# EAGLE schematic ECEN 4350 Lab 3 (EAGLE 9.6.2)

## Sheet 1 of 7
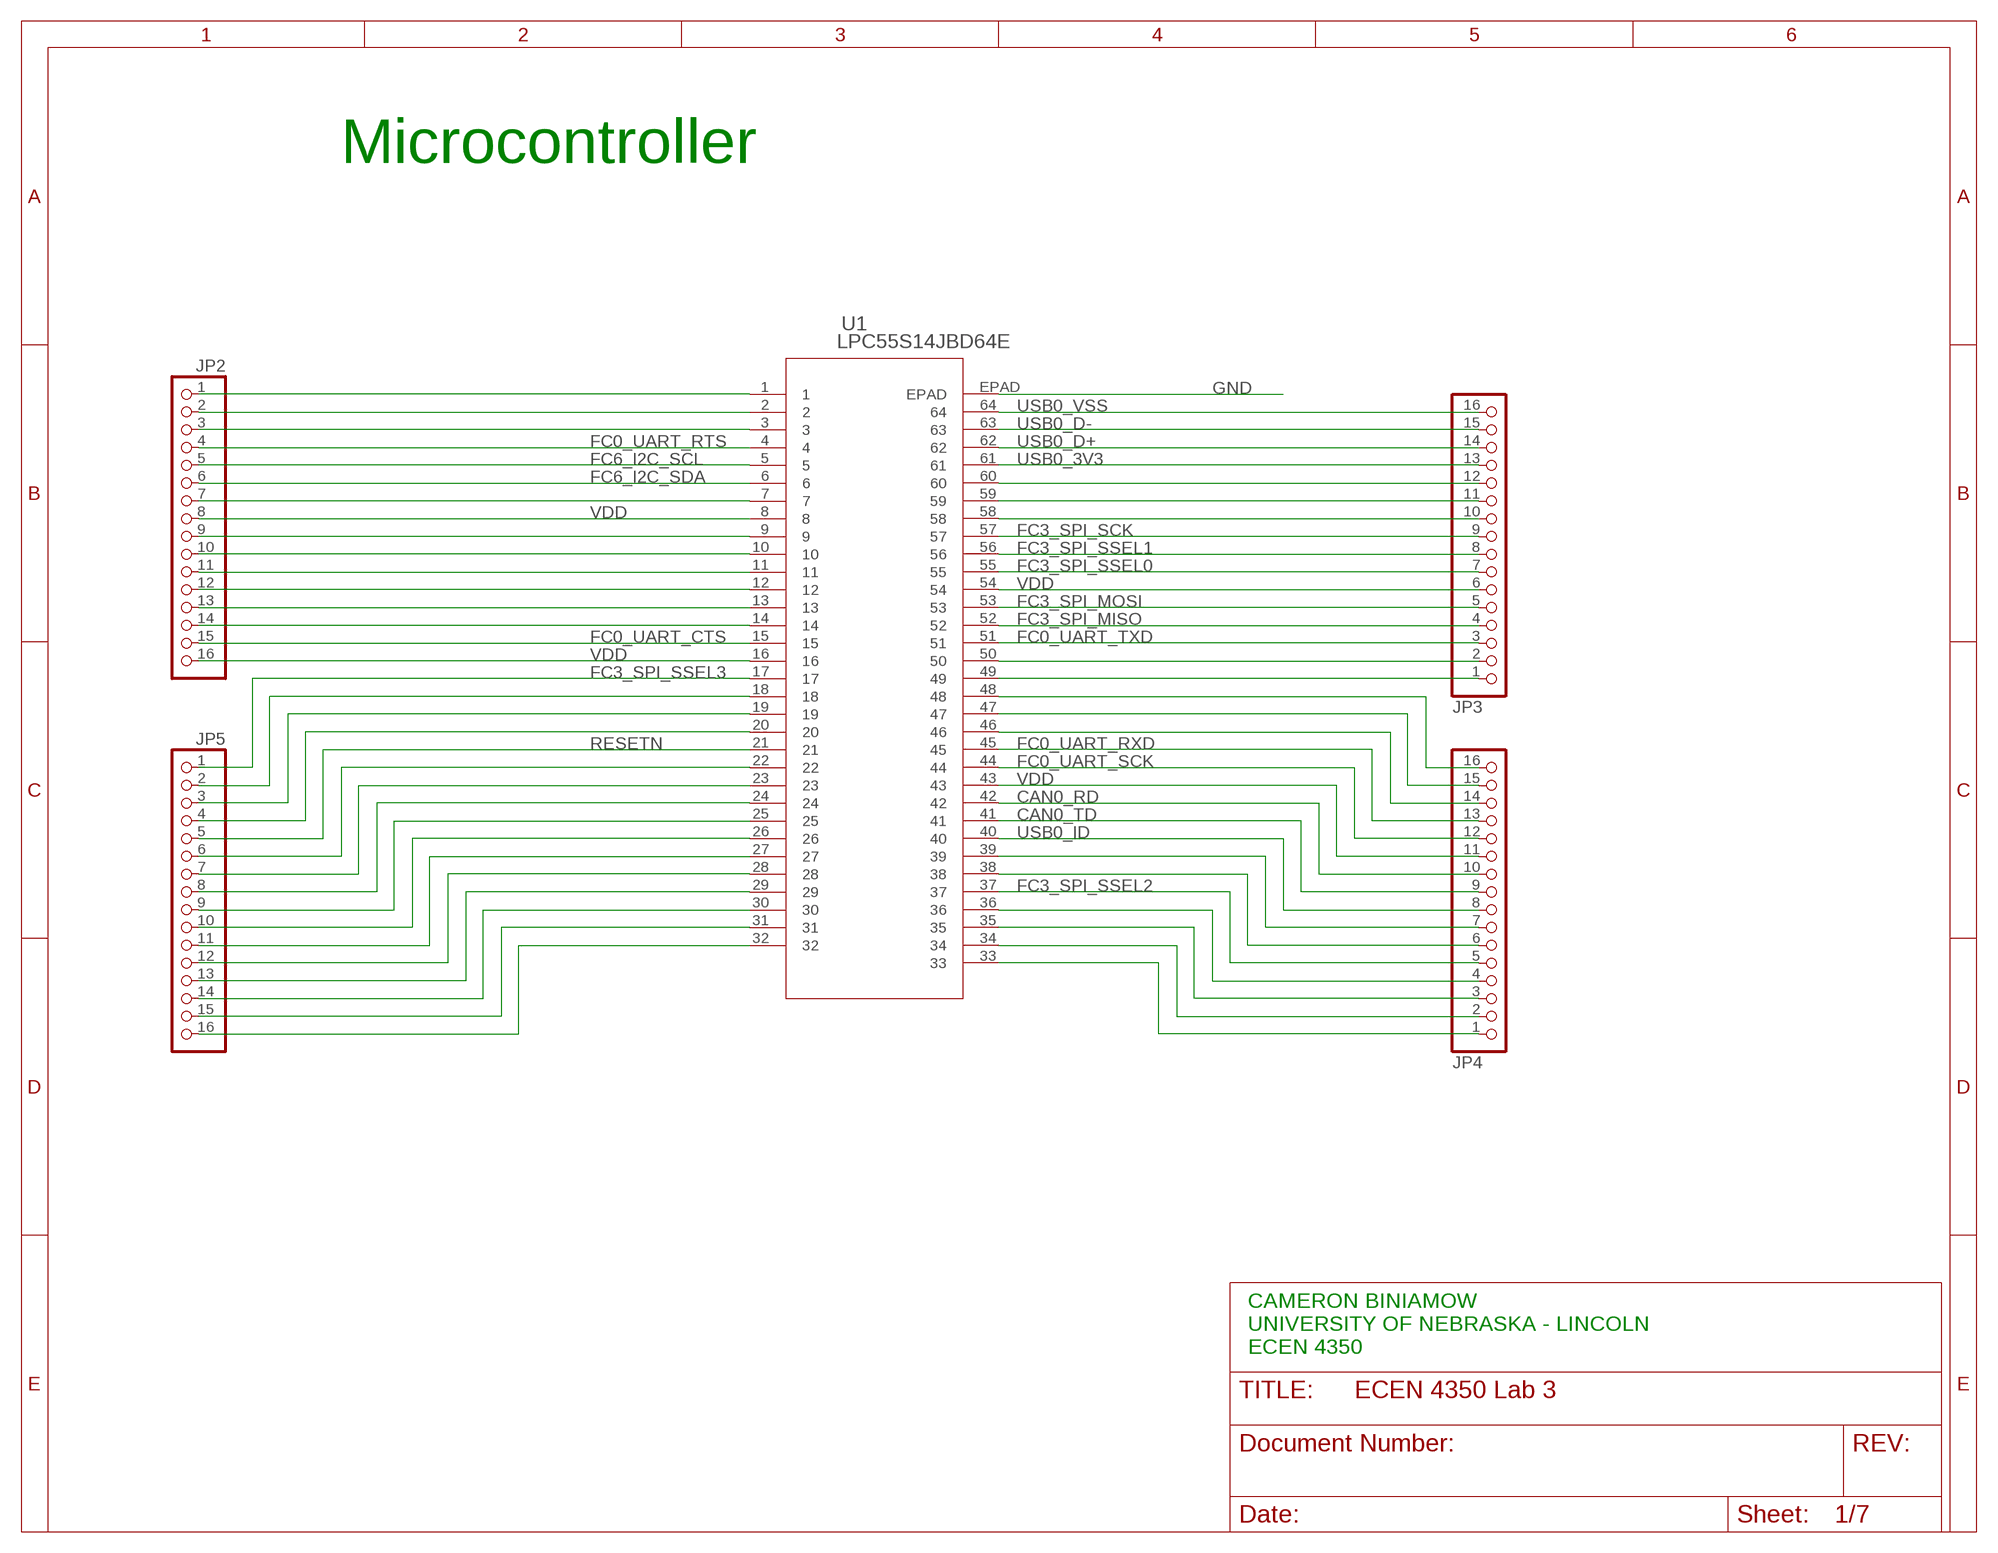
[diagram p0: schematic, sheet 1]

### Parts
JP2  PINHD-1X16  [1X16]
JP3  PINHD-1X16  [1X16]
JP4  PINHD-1X16  [1X16]
JP5  PINHD-1X16  [1X16]
U1  LPC55S14JBD64E  [HTQFP64_10X10_NXP]

### Nets
CAN0_RD: JP4.10 U1.42 ; also sheet 2
CAN0_TD: JP4.9 U1.41 ; also sheet 2
FC0_UART_CTS: JP2.15 U1.15
FC0_UART_RTS: JP2.4 U1.4
FC0_UART_RXD: JP4.13 U1.45 ; also sheet 4
FC0_UART_SCK: JP4.12 U1.44
FC0_UART_TXD: JP3.3 U1.51 ; also sheet 4
FC2_I2C_SCL: JP5.2 U1.18 ; also sheet 7
FC3_SPI_MISO: JP3.4 U1.52 ; also sheet 5,6
FC3_SPI_MOSI: JP3.5 U1.53 ; also sheet 5,6
FC3_SPI_SCK: JP3.9 JP4.4 U1.36 U1.57 ; also sheet 5,6
FC3_SPI_SSEL0: JP3.7 U1.55 ; also sheet 5
FC3_SPI_SSEL1: JP3.8 U1.56 ; also sheet 6
FC3_SPI_SSEL2: JP4.5 U1.37
FC3_SPI_SSEL3: JP5.1 U1.17
FC6_I2C_SCL: JP2.5 U1.5 ; also sheet 6,7
FC6_I2C_SDA: JP2.6 U1.6 ; also sheet 6,7
GND: U1.EPAD ; also sheet 4,6,7
N$1: JP2.1 U1.1
N$2: JP2.2 U1.2
N$3: JP2.3 U1.3
N$7: JP2.7 U1.7
N$9: JP2.9 U1.9
N$10: JP2.10 U1.10
N$11: JP2.11 U1.11
N$12: JP2.12 U1.12
N$13: JP2.13 U1.13
N$14: JP2.14 U1.14
N$19: JP5.3 U1.19
N$20: JP5.4 U1.20
N$22: JP5.6 U1.22
N$23: JP5.7 U1.23
N$24: JP5.8 U1.24
N$25: JP5.9 U1.25
N$26: JP5.10 U1.26
N$27: JP5.11 U1.27
N$28: JP5.12 U1.28
N$29: JP5.13 U1.29
N$30: JP5.14 U1.30
N$31: JP5.15 U1.31
N$32: JP5.16 U1.32
N$40: JP3.12 U1.60
N$41: JP3.11 U1.59
N$42: JP3.10 U1.58
N$50: JP3.2 U1.50
N$51: JP3.1 U1.49
N$52: JP4.16 U1.48
N$53: JP4.15 U1.47
N$54: JP4.14 U1.46
N$62: JP4.7 U1.39
N$63: JP4.6 U1.38
N$66: JP4.3 U1.35
N$67: JP4.2 U1.34
N$68: JP4.1 U1.33
RESETN: JP5.5 U1.21
USB0_3V3: JP3.13 U1.61
USB0_D+: JP3.14 U1.62 ; also sheet 3
USB0_D-: JP3.15 U1.63 ; also sheet 3
USB0_ID: JP4.8 U1.40 ; also sheet 3
USB0_VSS: JP3.16 U1.64
VDD: JP2.8 JP2.16 JP3.6 JP4.11 U1.8 U1.16 U1.43 U1.54

### Notes on the sheet
- Microcontroller
- CAMERON BINIAMOW
  UNIVERSITY OF NEBRASKA - LINCOLN
  ECEN 4350

## Sheet 2 of 7: Can Transceiver
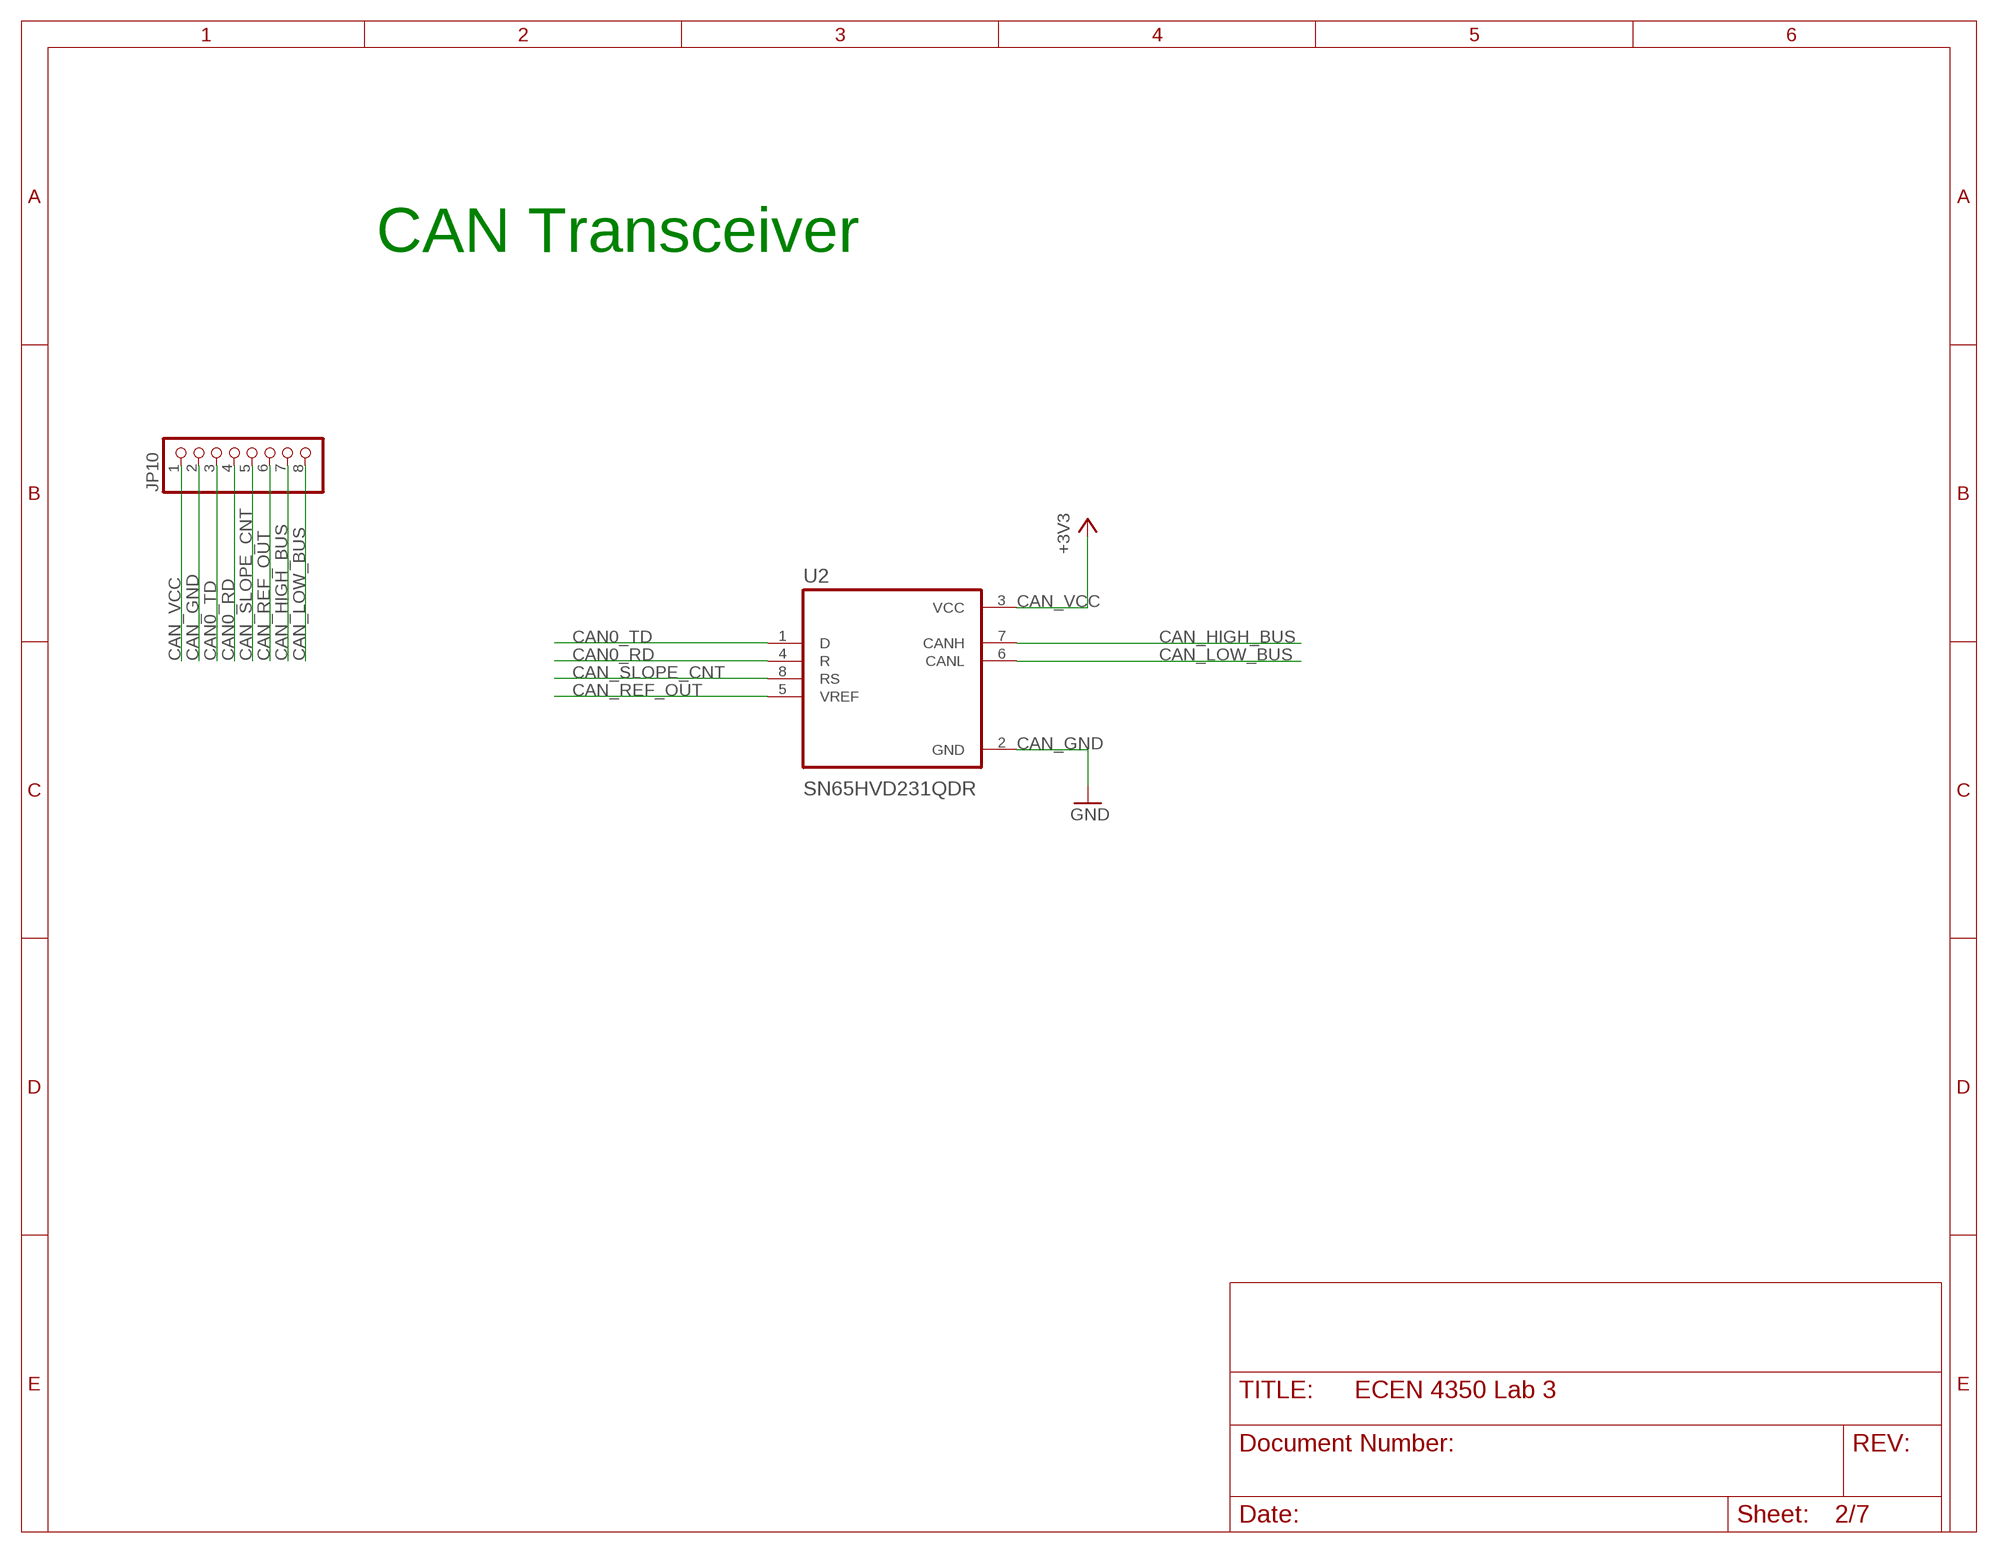
[diagram p1: schematic, sheet 2]

### Parts
JP10  PINHD-1X8  [1X08]
U2  SN65HVD231QDR  [SOIC127P599X175-8N]

### Nets
CAN0_RD: JP10.4 U2.4(R) ; also sheet 1
CAN0_TD: JP10.3 U2.1(D) ; also sheet 1
CAN_GND: JP10.2 U2.2(GND) ; supply symbol labelled GND
CAN_HIGH_BUS: JP10.7 U2.7(CANH)
CAN_LOW_BUS: JP10.8 U2.6(CANL)
CAN_REF_OUT: JP10.6 U2.5(VREF)
CAN_SLOPE_CNT: JP10.5 U2.8(RS)
CAN_VCC: JP10.1 U2.3(VCC) ; supply symbol labelled +3V3

### Notes on the sheet
- CAN Transceiver

## Sheet 3 of 7
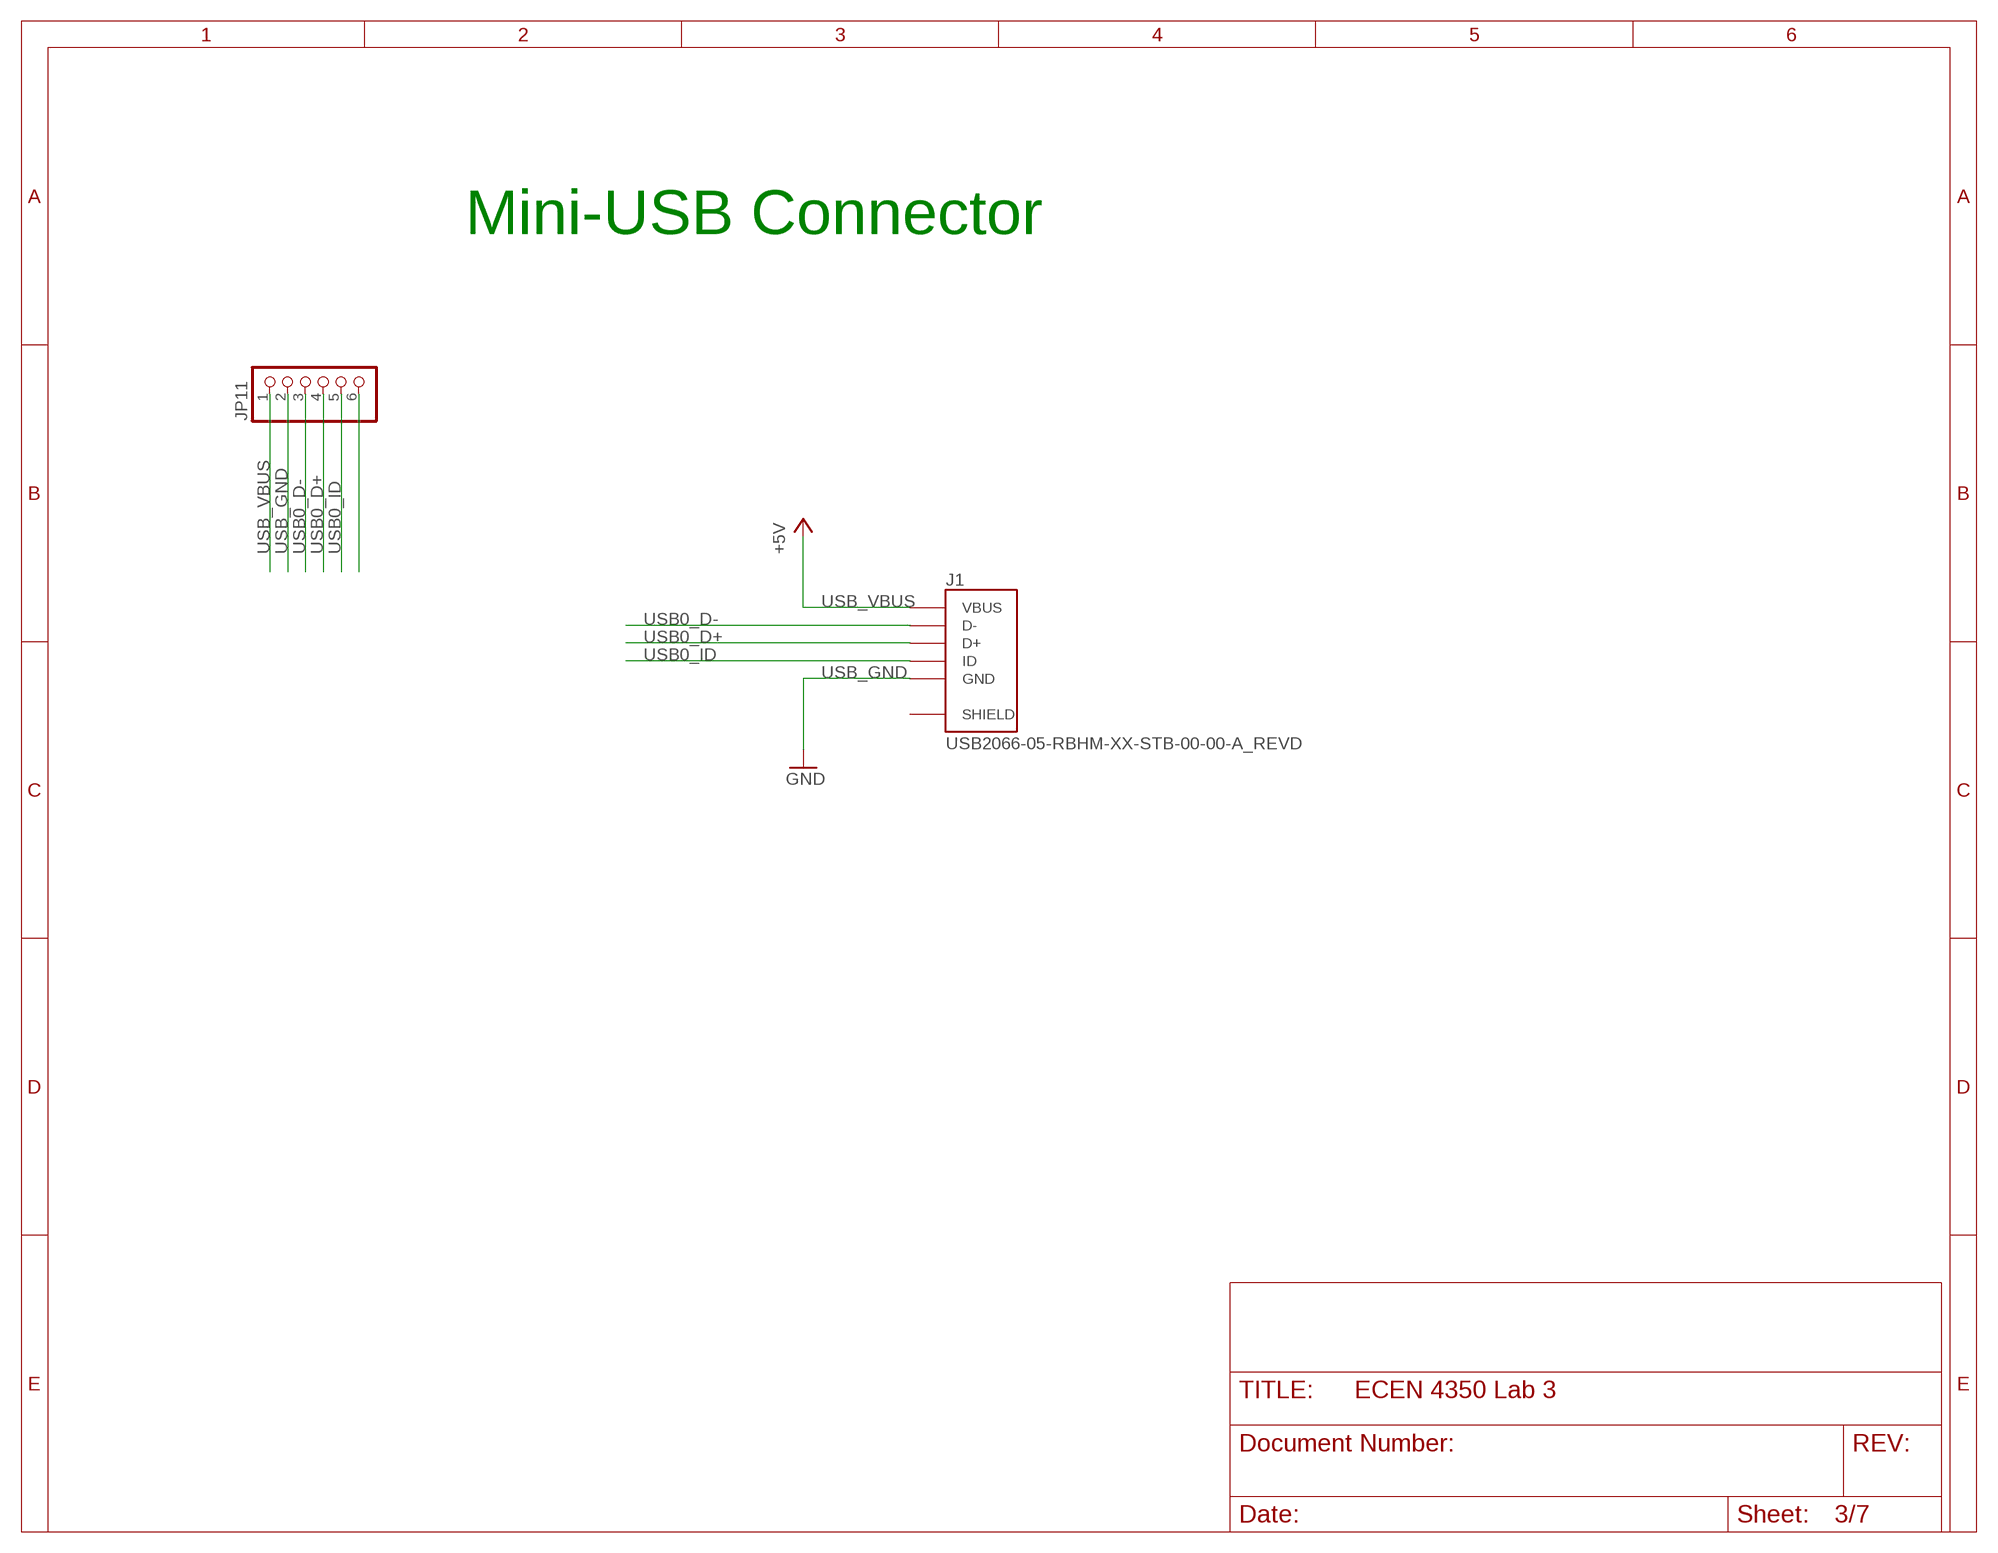
[diagram p2: schematic, sheet 3]

### Parts
J1  USB2066-05-RBHM-XX-STB-00-00-A_REVD  [GCT_USB2066-05-RBHM-XX-STB-00-00-A_REVD]
JP11  PINHD-1X6  [1X06]

### Nets
N$16: JP11.6
USB0_D+: J1.3(D+) JP11.4 ; also sheet 1
USB0_D-: J1.2(D-) JP11.3 ; also sheet 1
USB0_ID: J1.4(ID) JP11.5 ; also sheet 1
USB_GND: J1.5(GND) JP11.2 ; supply symbol labelled GND
USB_VBUS: J1.1(VBUS) JP11.1 ; supply symbol labelled +5V

### Notes on the sheet
- Mini-USB Connector

## Sheet 4 of 7
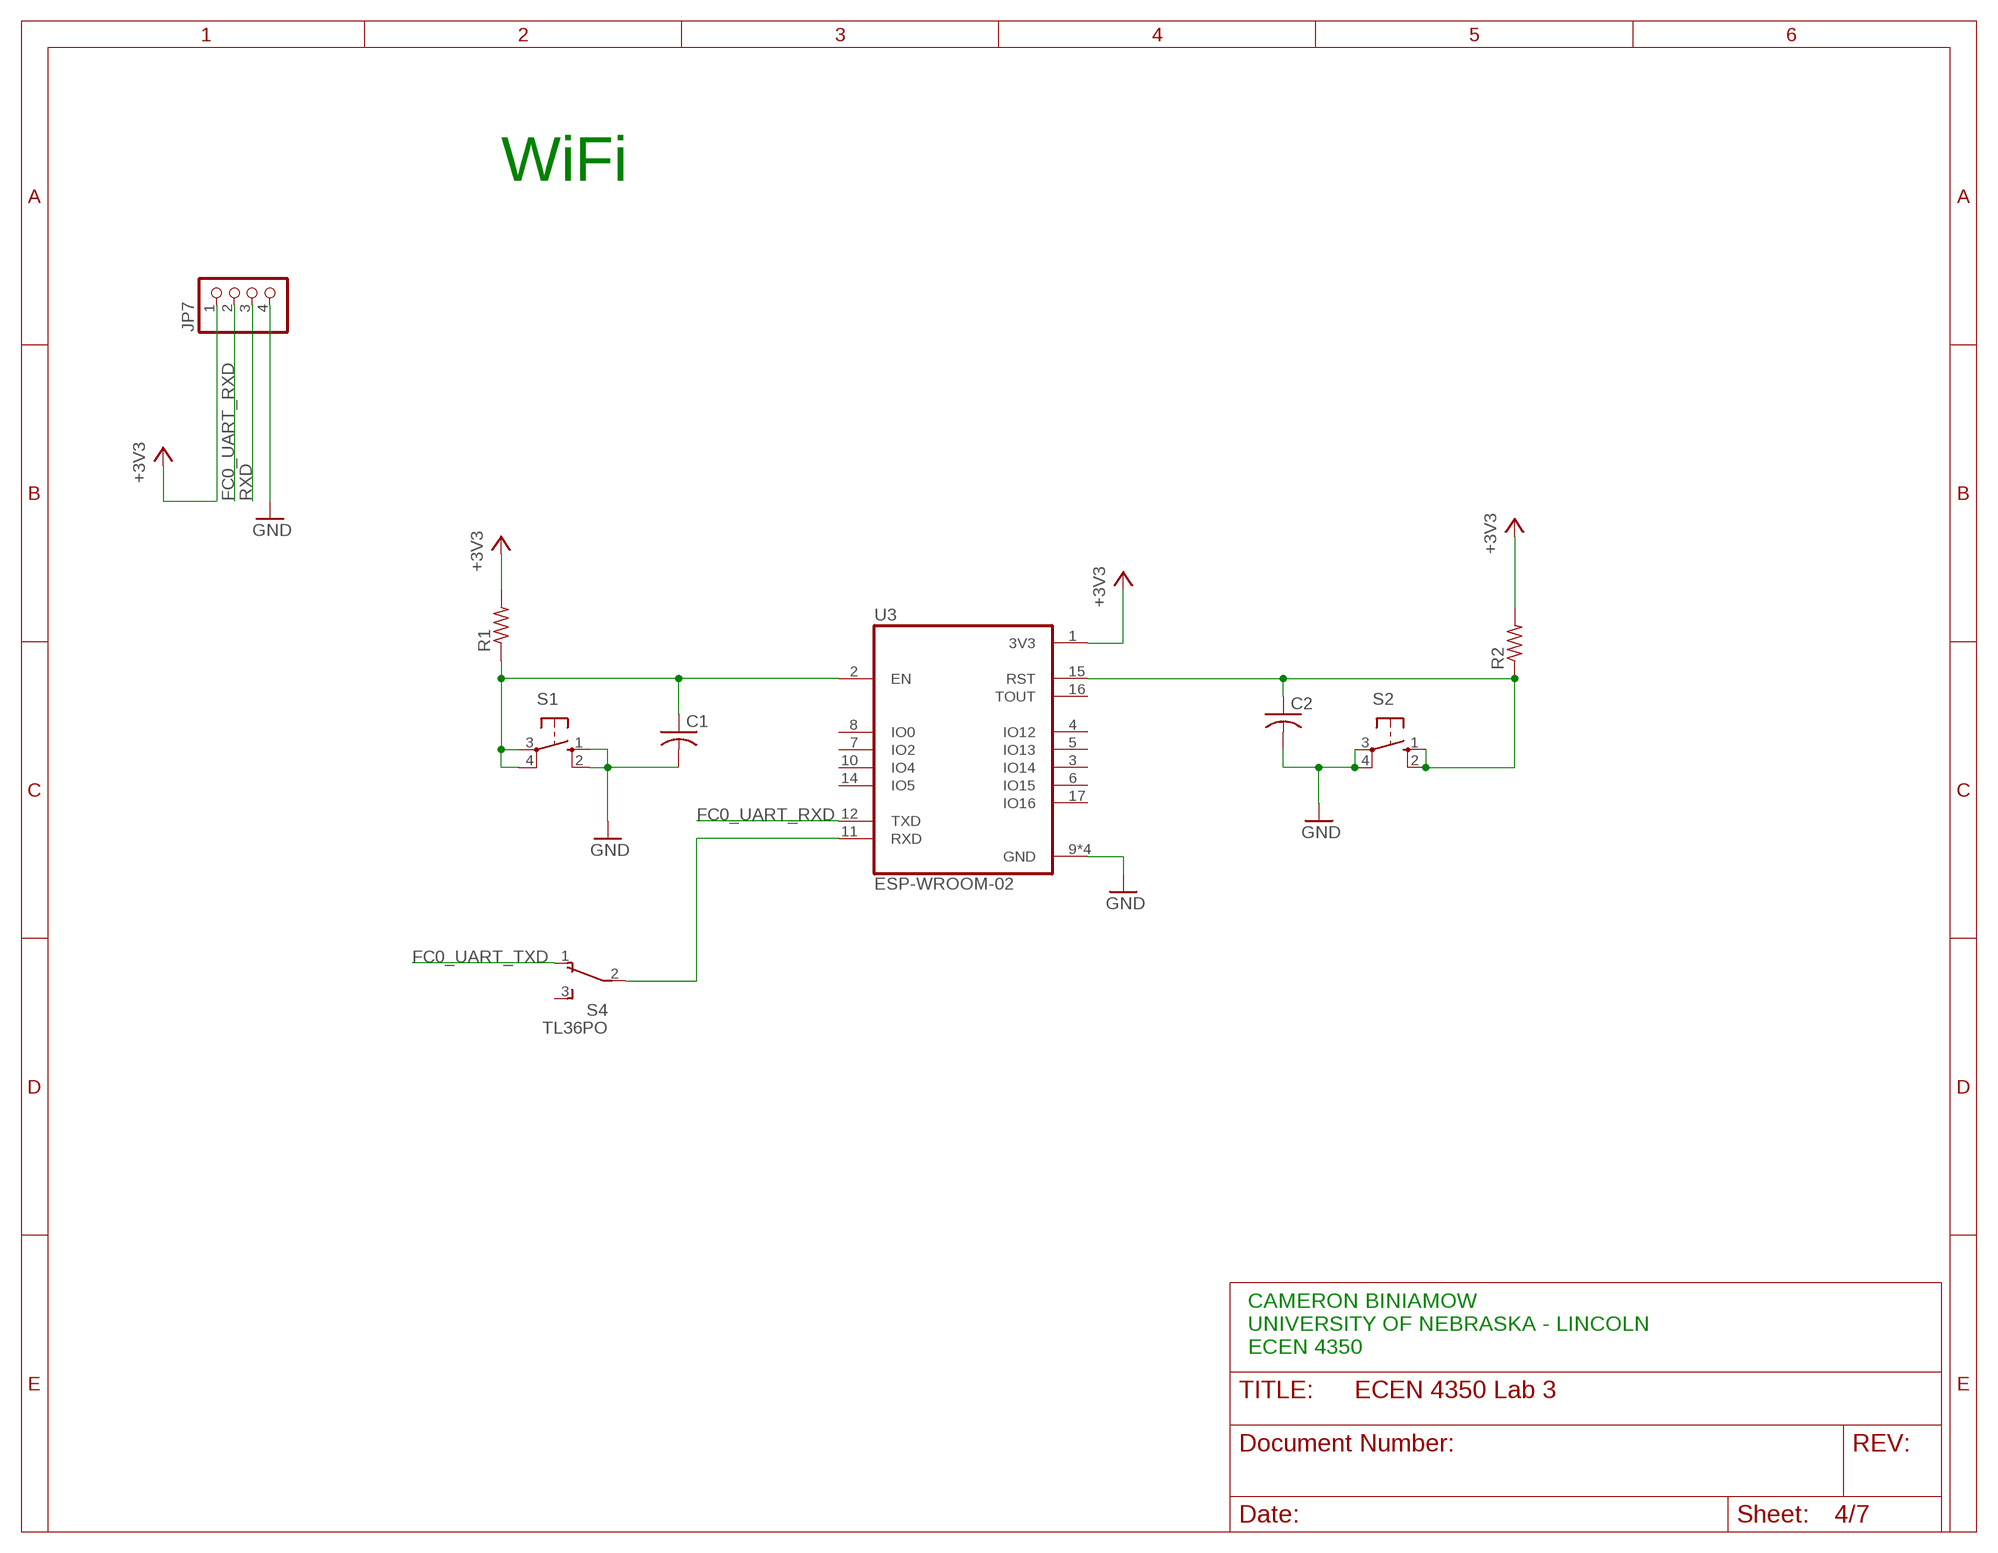
[diagram p3: schematic, sheet 4]

### Parts
C1  C-USC1206  [C1206]
C2  C-USC1206  [C1206]
JP7  PINHD-1X4  [1X04]
R1  R-US_R1206  [R1206]
R2  R-US_R1206  [R1206]
S1  10-XX  [B3F-10XX]
S2  10-XX  [B3F-10XX]
S4  TL36PO  [TL3XPO]
U3  ESP-WROOM-02  [MODULE_ESP-WROOM-02]

### Nets
+3V3: JP7.1 R1.2 R2.2 U3.1(3V3) ; also sheet 7
FC0_UART_RXD: JP7.2 U3.12(TXD) ; also sheet 1
FC0_UART_TXD: S4.1(O) ; also sheet 1
GND: C1.2 C2.2 JP7.4 S1.1(S) S1.2(S1) S2.3(P) S2.4(P1) U3.9(GND) U3.13(GND) U3.18(GND) U3.19(GND) ; also sheet 1,6,7
N$33: C1.1 R1.1 S1.3(P) S1.4(P1) U3.2(EN)
N$34: C2.1 R2.1 S2.1(S) S2.2(S1) U3.15(RST)
RXD: JP7.3 S4.2(P) U3.11(RXD)
Unconnected: S4.3(S) U3.3(IO14) U3.4(IO12) U3.5(IO13) U3.6(IO15) U3.7(IO2) U3.8(IO0) U3.10(IO4) U3.14(IO5) U3.16(TOUT) U3.17(IO16)

### Notes on the sheet
- WiFi
- CAMERON BINIAMOW
  UNIVERSITY OF NEBRASKA - LINCOLN
  ECEN 4350

## Sheet 5 of 7
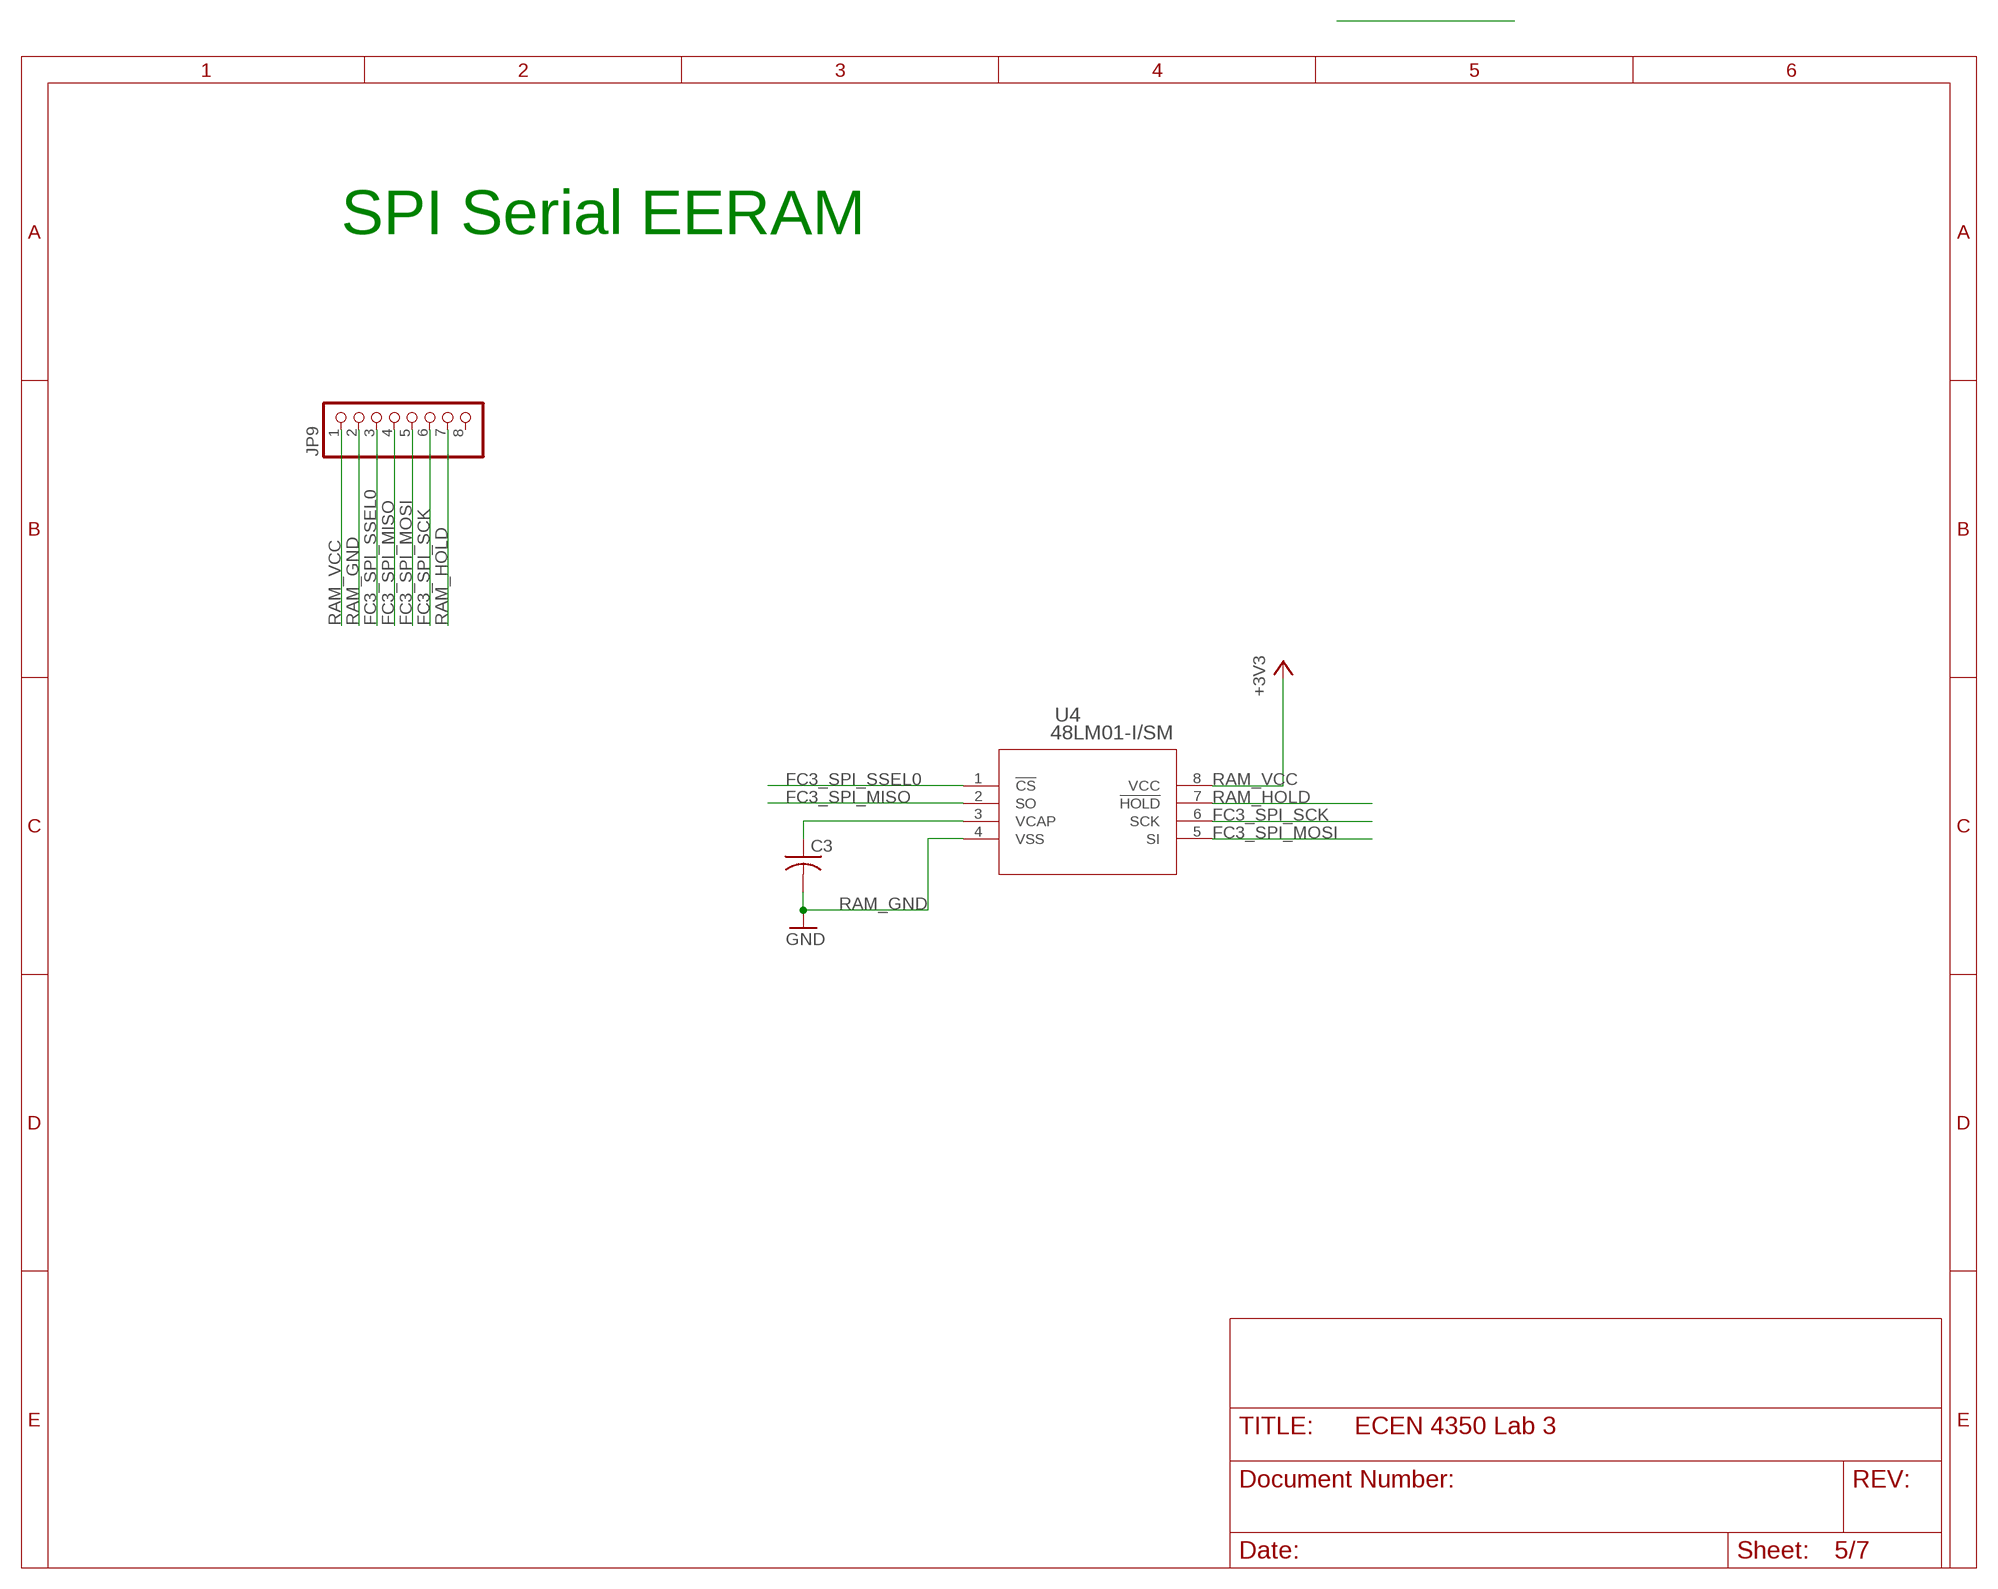
[diagram p4: schematic, sheet 5]

### Parts
C3  C-USC1206  [C1206]
JP9  PINHD-1X8  [1X08]
U4  48LM01-I/SM  [SOIJ8_SM_MCH]

### Nets
FC3_SPI_MISO: JP9.4 U4.2(SO) ; also sheet 1,6
FC3_SPI_MOSI: JP9.5 U4.5(SI) ; also sheet 1,6
FC3_SPI_SCK: JP9.6 U4.6(SCK) ; also sheet 1,6
FC3_SPI_SSEL0: JP9.3 U4.1(!CS) ; also sheet 1
N$35: C3.1 U4.3(VCAP)
N$74: U2.1(D)
RAM_GND: C3.2 JP9.2 U4.4(VSS) ; supply symbol labelled GND
RAM_HOLD: JP9.7 U4.7(!HOLD)
RAM_VCC: JP9.1 U4.8(VCC) ; supply symbol labelled +3V3
Unconnected: JP9.8

### Notes on the sheet
- SPI Serial EERAM

## Sheet 6 of 7
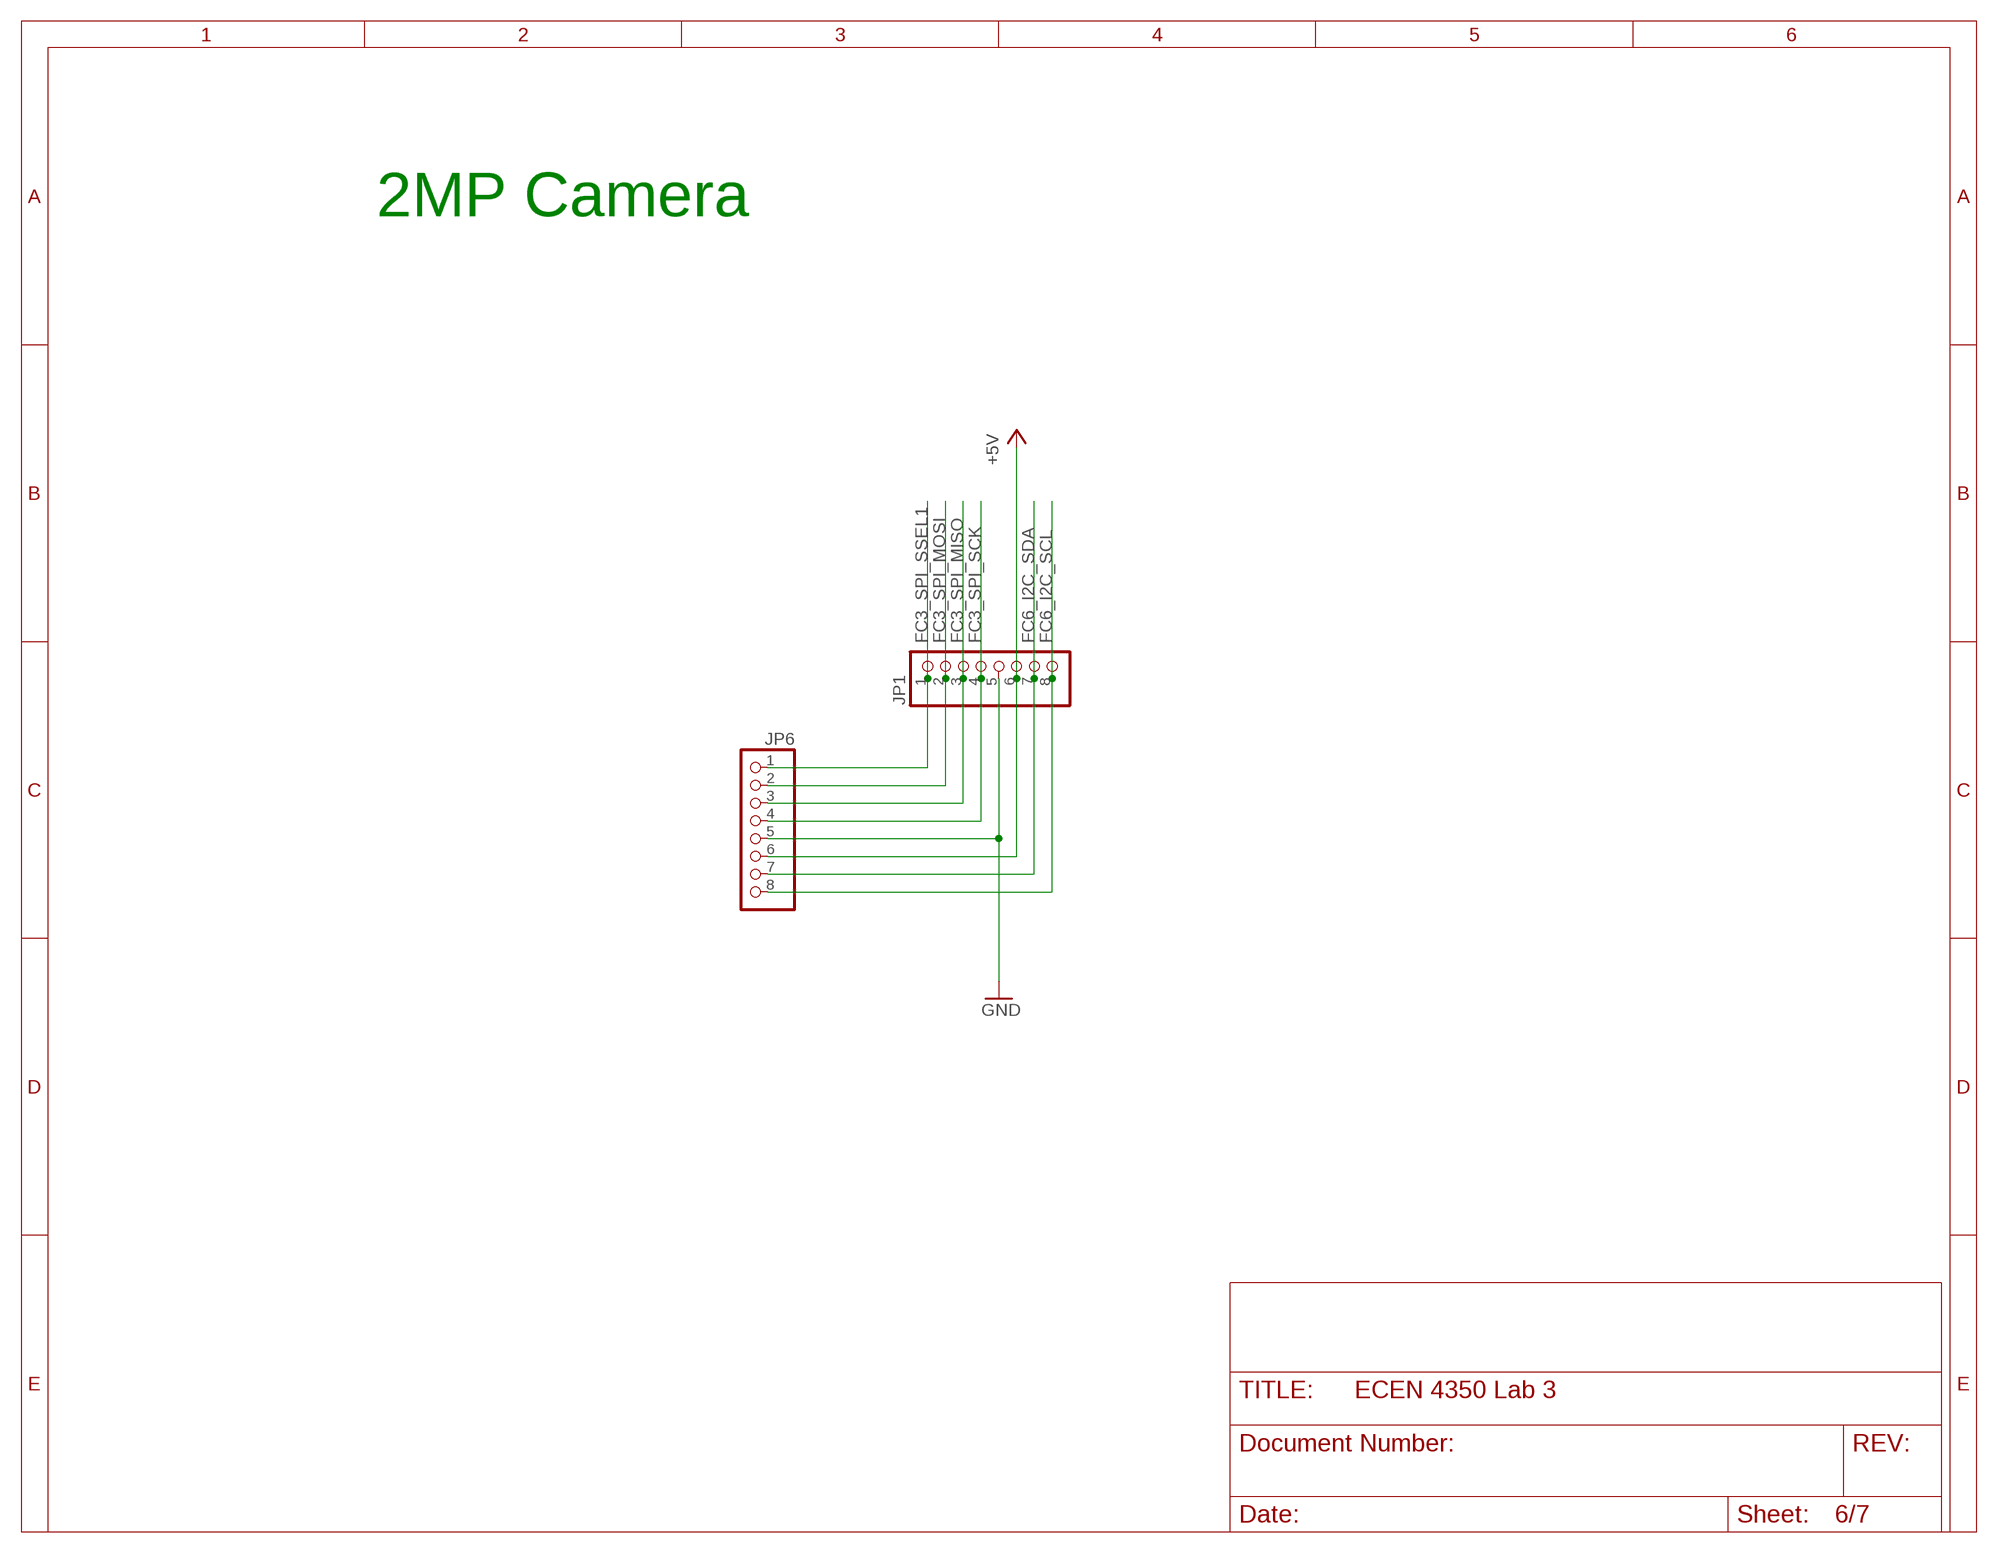
[diagram p5: schematic, sheet 6]

### Parts
JP1  PINHD-1X8  [1X08]
JP6  PINHD-1X8  [1X08]

### Nets
+5V: JP1.6 JP6.6
FC3_SPI_MISO: JP1.3 JP6.3 ; also sheet 1,5
FC3_SPI_MOSI: JP1.2 JP6.2 ; also sheet 1,5
FC3_SPI_SCK: JP1.4 JP6.4 ; also sheet 1,5
FC3_SPI_SSEL1: JP1.1 JP6.1 ; also sheet 1
FC6_I2C_SCL: JP1.8 JP6.8 ; also sheet 1,7
FC6_I2C_SDA: JP1.7 JP6.7 ; also sheet 1,7
GND: JP1.5 JP6.5 ; also sheet 1,4,7

### Notes on the sheet
- 2MP Camera

## Sheet 7 of 7
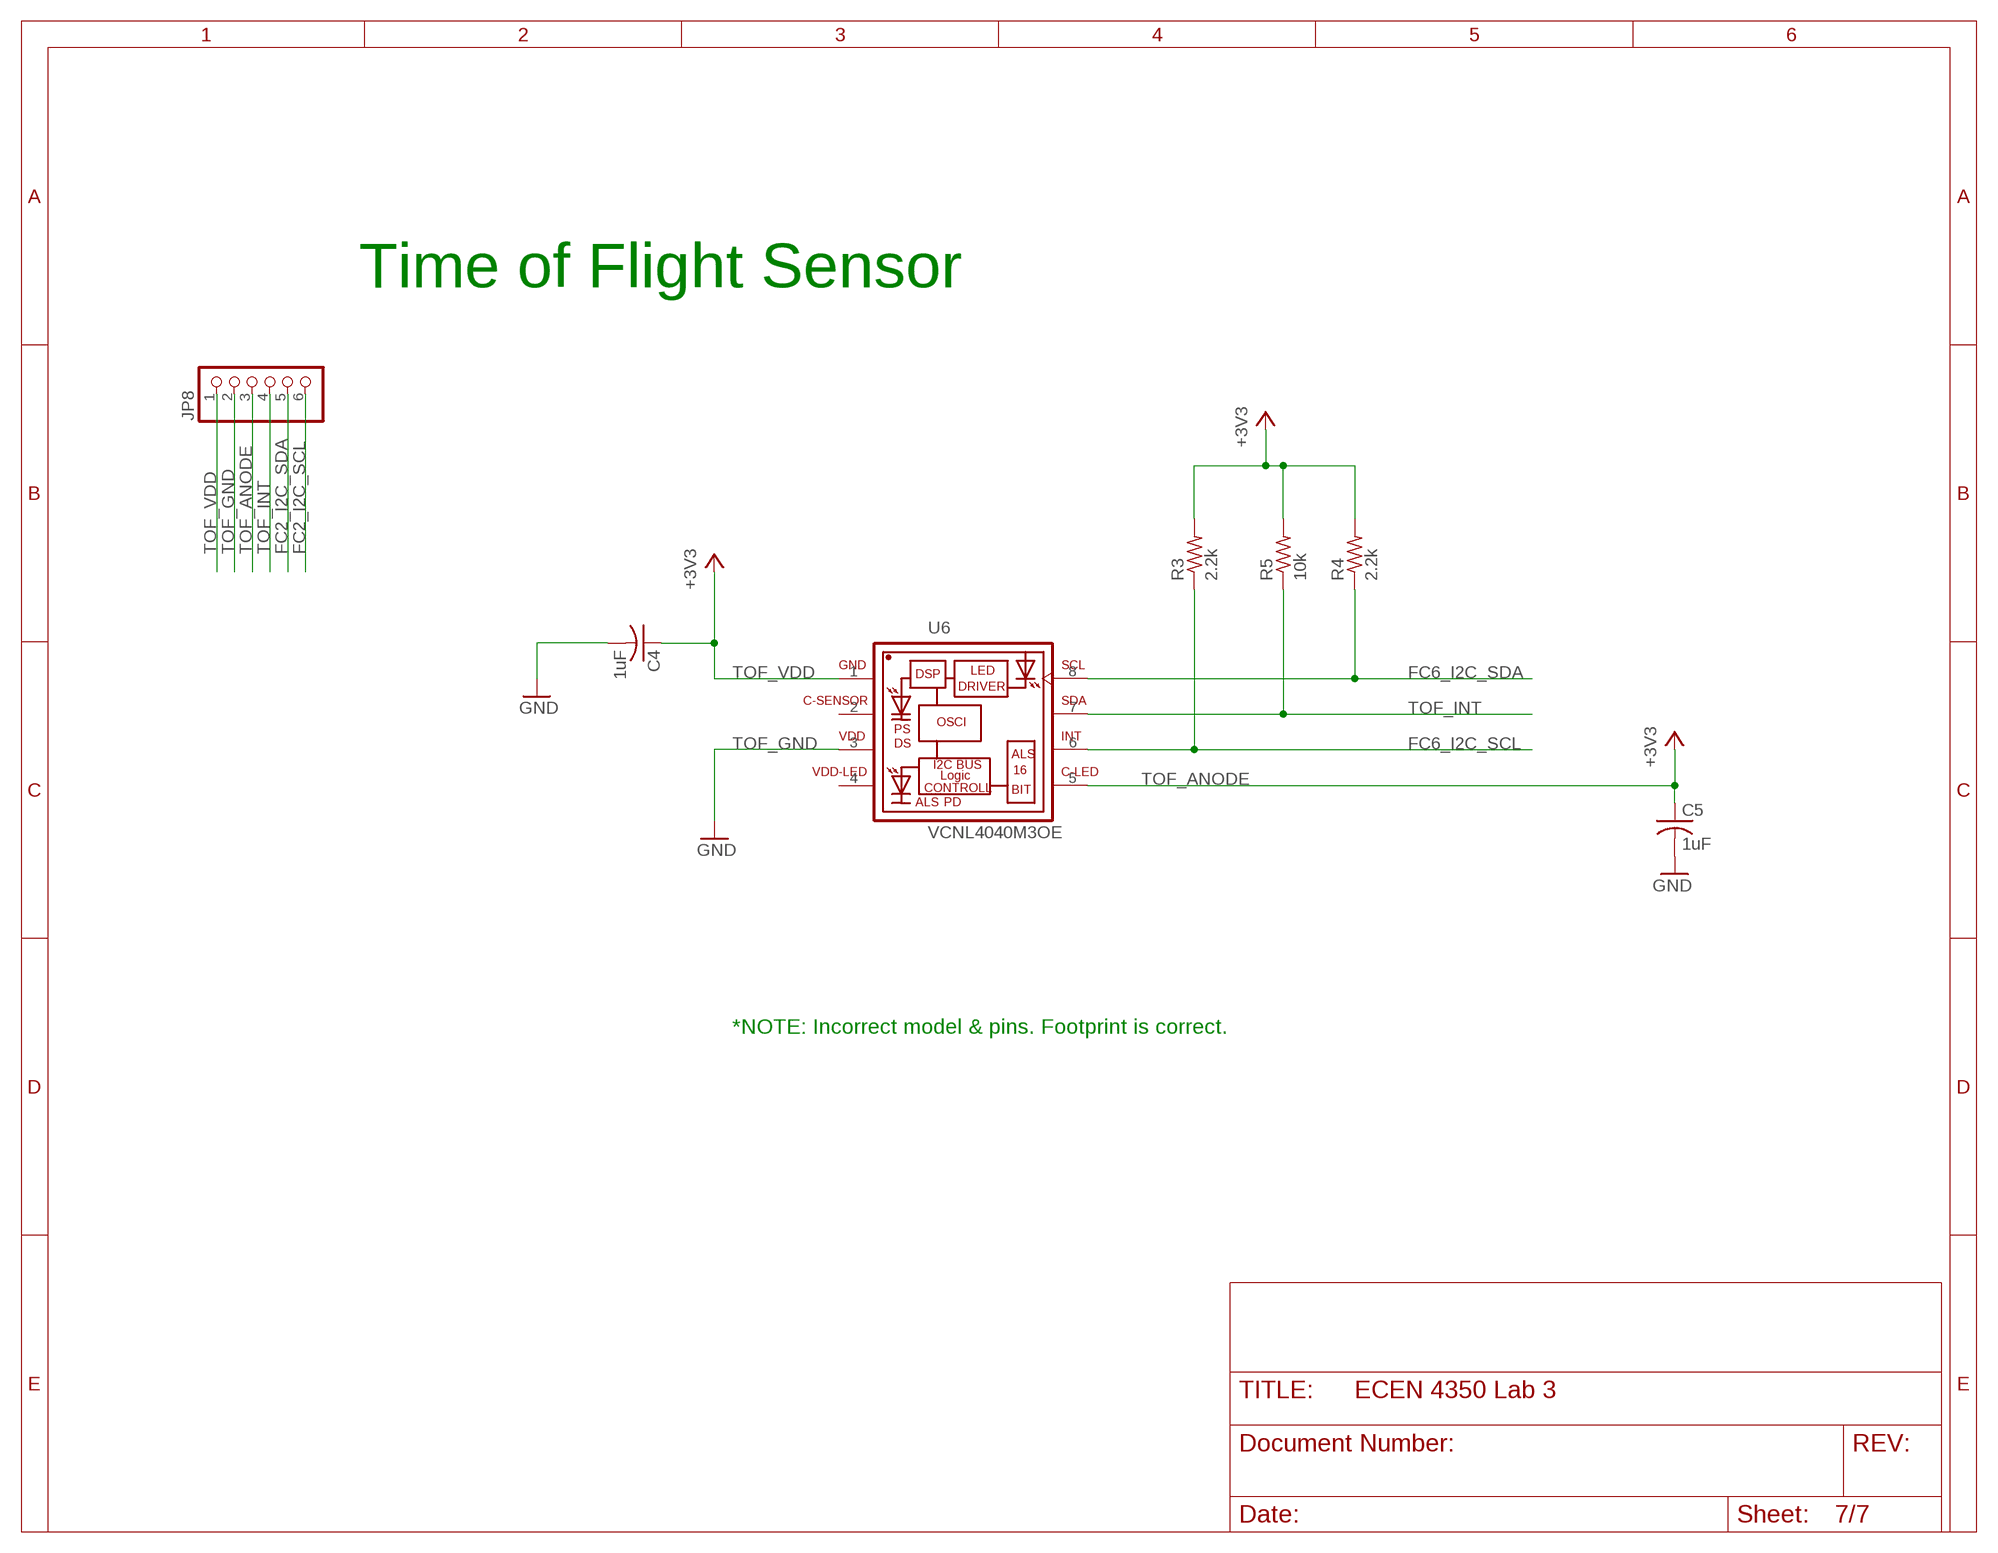
[diagram p6: schematic, sheet 7]

### Parts
C4  1uF  C-USC1206  [C1206]
C5  1uF  C-USC1206  [C1206]
JP8  PINHD-1X6  [1X06]
R3  2.2k  R-US_M1206  [M1206]
R4  2.2k  R-US_M1206  [M1206]
R5  10k  R-US_M1206  [M1206]
U6  VCNL4040M3OE  [VISHAY_VCNL4040_4X2X1.1]

### Nets
+3V3: R3.2 R4.2 R5.2 ; also sheet 4
FC2_I2C_SCL: JP8.6 ; also sheet 1
FC2_I2C_SDA: JP8.5
FC6_I2C_SCL: R3.1 U6.6(INT) ; also sheet 1,6
FC6_I2C_SDA: R4.1 U6.8(SCL) ; also sheet 1,6
GND: C4.2 C5.2 ; also sheet 1,4,6
TOF_ANODE: C5.1 JP8.3 U6.5(C-LED) ; supply symbol labelled +3V3
TOF_GND: JP8.2 U6.3(VDD) ; supply symbol labelled GND
TOF_INT: JP8.4 R5.1 U6.7(SDA)
TOF_VDD: C4.1 JP8.1 U6.1(GND) ; supply symbol labelled +3V3
Unconnected: U6.2(C-SENSOR)

### Notes on the sheet
- Time of Flight Sensor
- *NOTE: Incorrect model & pins. Footprint is correct.

## Power pins joined to a net without a drawn wire
SHIELD: J1.6(SHIELD) J1.7(SHIELD) J1.8(SHIELD) J1.9(SHIELD)
VDD-LED: U6.4(VDD-LED)

## Library data of the parts
C1-C5 = rcl:C-US: CAPACITOR, American symbol; SPICEPREFIX: C
J1 = USB2066-05-RBHM-XX-STB-00-00-A_REVD:USB2066-05-RBHM-XX-STB-00-00-A_REVD: Mimi USB Receptacle, Type B, 5 Pin, SMT, Horizontal, Optional Post, 9.40mm Length; DESCRIPTION: USB - mini B USB 2.0 Receptacle Connector 5 Position Surface Mount, Right Angle; DIGI-KEY_PART_NUMBER: 2073-USB2066-05-RBHM-15-STB-00-00-ACT-ND; MF: Global Connector Technology; MP: USB2066-05-RBHM-15-STB-00-00-A; PACKAGE: None; PURCHASE-URL: https://pricing.snapeda.com/search/part/USB2066-05-RBHM-15-STB-00-00-A/?ref=eda
JP1 JP6 JP9 JP10 = pinhead:PINHD-1X8: PIN HEADER
JP2-JP5 = pinhead:PINHD-1X16: PIN HEADER
JP7 = pinhead:PINHD-1X4: PIN HEADER
JP8 JP11 = pinhead:PINHD-1X6: PIN HEADER
R1-R5 = rcl:R-US_: RESISTOR, American symbol; SPICEPREFIX: R
S1 S2 = switch-omron:10-XX: OMRON SWITCH; MPN: B3F-1000; OC_FARNELL: 176432; OC_NEWARK: 36M3542
S4 = switch:TL36PO: TINY SWITCH ON - ON Source: http://www2.produktinfo.conrad.com/datenblaetter/700000-724999/705152-da-01-de-Subminiaturschalter_TL_36YO.pdf
U1 = LPC55S14JBD64E:LPC55S14JBD64E; COPYRIGHT: Copyright (C) 2021 Ultra Librarian. All rights reserved.; MANUFACTURER_PART_NUMBER: LPC55S14JBD64E; MFR_NAME: NXP
U2 = SN65HVD231QDR:SN65HVD231QDR: Check prices <https://pricing.snapeda.com/parts/SN65HVD231QDR/Texas%20Instruments/view-part?ref=eda>; AVAILABILITY: In Stock; DESCRIPTION: 3.3-V CAN Transceiver with Sleep Mode 8-SOIC -40 to 125; MF: Texas Instruments; MP: SN65HVD231QDR; PACKAGE: SOIC-8 Texas Instruments; PRICE: None; PURCHASE-URL: https://pricing.snapeda.com/search/part/SN65HVD231QDR/?ref=eda
U3 = ESP-WROOM-02:ESP-WROOM-02: Wi-Fi Module w/ESP8266 802.11b/g/n 20dBm 20x18x3mm; DESCRIPTION: WiFi 802.11b/g/n Transceiver Module 2.4GHz ~ 2.5GHz Integrated, Trace Surface Mount; DIGI-KEY_PART_NUMBER: 1904-1009-1-ND; MF: Espressif Systems; MP: ESP-WROOM-02; PACKAGE: SMD-18 Espressif Systems; PURCHASE-URL: https://pricing.snapeda.com/search/part/ESP-WROOM-02/?ref=eda
U4 = 48LM01-I_SM:48LM01-I/SM; COPYRIGHT: Copyright (C) 2021 Ultra Librarian. All rights reserved.; DIGI-KEY_PART_NUMBER_1: 150-48LM01-I/SM-ND; MANUFACTURER_PART_NUMBER: 48LM01-I/SM; MFR_NAME: Microchip
U6 = VCNL4040M3OE:VCNL4040M3OE: VCNL4040 Fully Integrated Proximity and Ambient Light Sensor with Infrared Emitter, I2C Interface, and Interrupt Function: VCNL4040 integrates a proximity sensor (PS), ambient light sensor (ALS), and a high power IRED into one small package. It incorporates photodiodes, amplifiers, and analog to digital converting circuits into a single chip by CMOS process. The 16-bit high resolution ALS offers excellent sensing capabilities with sufficient selections to fulfill most applications whether dark or high transparency lens design. High and low interrupt thresholds can be programmed for both ALS and PS, allowing the component to use a minimal amount of the microcontrollers resources. Device Model created 15.06.2016 by Johannes Kolb - Vishay Semiconductor GmbH Check prices <https://pricing.snapeda.com/parts/VCNL4040M3OE/Vishay/view-part?ref=eda>; AVAILABILITY: In Stock; DESCRIPTION: Optical Sensor Ambient 550nm I²C 8-SMD Module; MF: Vishay; MP: VCNL4040M3OE; PACKAGE: SMD-8 Vishay; PRICE: None; PURCHASE-URL: https://pricing.snapeda.com/search/part/VCNL4040M3OE/?ref=eda